# EAGLE schematic H04 (EAGLE 6.6.0)

## Sheet 1 of 4
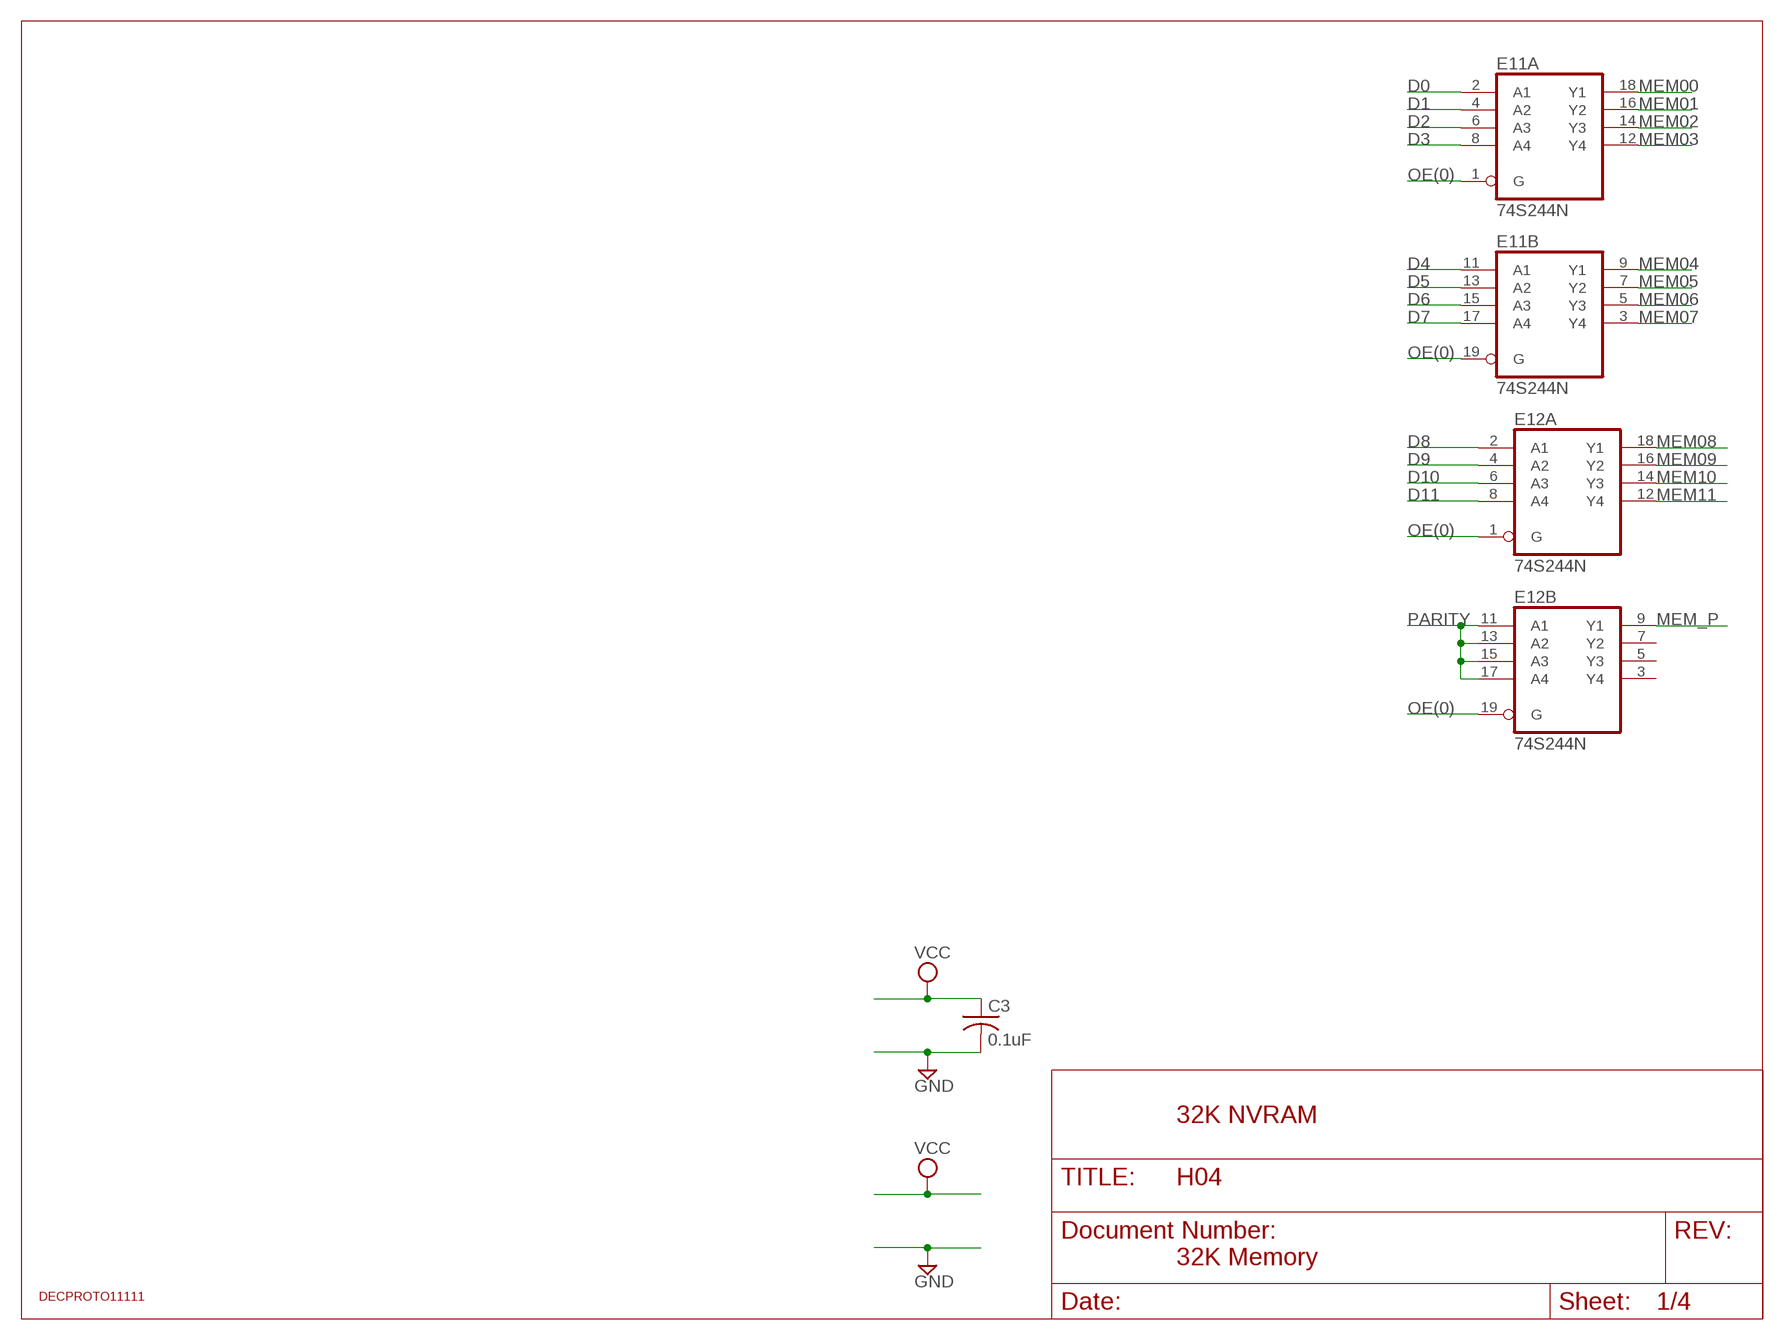
[diagram p0: schematic, sheet 1]

### Parts
C3  0.1uF  C-US050-025X075  [C050-025X075]
E11  74S244N  [DIL20]
E12  74S244N  [DIL20]
U$6  DECPROTO11111  [DECPROTO11111]

### Nets
D0: E11.2(A:A1) ; also sheet 3
D1: E11.4(A:A2) ; also sheet 3
D2: E11.6(A:A3) ; also sheet 3
D3: E11.8(A:A4) ; also sheet 3
D4: E11.11(B:A1) ; also sheet 3
D5: E11.13(B:A2) ; also sheet 3
D6: E11.15(B:A3) ; also sheet 3
D7: E11.17(B:A4) ; also sheet 3
D8: E12.2(A:A1) ; also sheet 3
D9: E12.4(A:A2) ; also sheet 3
D10: E12.6(A:A3) ; also sheet 3
D11: E12.8(A:A4) ; also sheet 3
GND [supply]: C3.2 ; also sheet 2,3
MEM00: E11.18(A:Y1) ; also sheet 2
MEM01: E11.16(A:Y2) ; also sheet 2
MEM02: E11.14(A:Y3) ; also sheet 2
MEM03: E11.12(A:Y4) ; also sheet 2
MEM04: E11.9(B:Y1) ; also sheet 2
MEM05: E11.7(B:Y2) ; also sheet 2
MEM06: E11.5(B:Y3) ; also sheet 2
MEM07: E11.3(B:Y4) ; also sheet 2
MEM08: E12.18(A:Y1) ; also sheet 3
MEM09: E12.16(A:Y2) ; also sheet 3
MEM10: E12.14(A:Y3) ; also sheet 3
MEM11: E12.12(A:Y4) ; also sheet 3
MEM_P: E12.9(B:Y1) ; also sheet 2
OE(0): E11.1(A:G) E11.19(B:G) E12.1(A:G) E12.19(B:G) ; also sheet 3
PARITY: E12.11(B:A1) E12.13(B:A2) E12.15(B:A3) E12.17(B:A4) ; also sheet 3
VCC [supply]: C3.1 ; also sheet 2
Unconnected: E12.3(B:Y4) E12.5(B:Y3) E12.7(B:Y2)

### Notes on the sheet
- 32K NVRAM
- 32K Memory

## Sheet 2 of 4
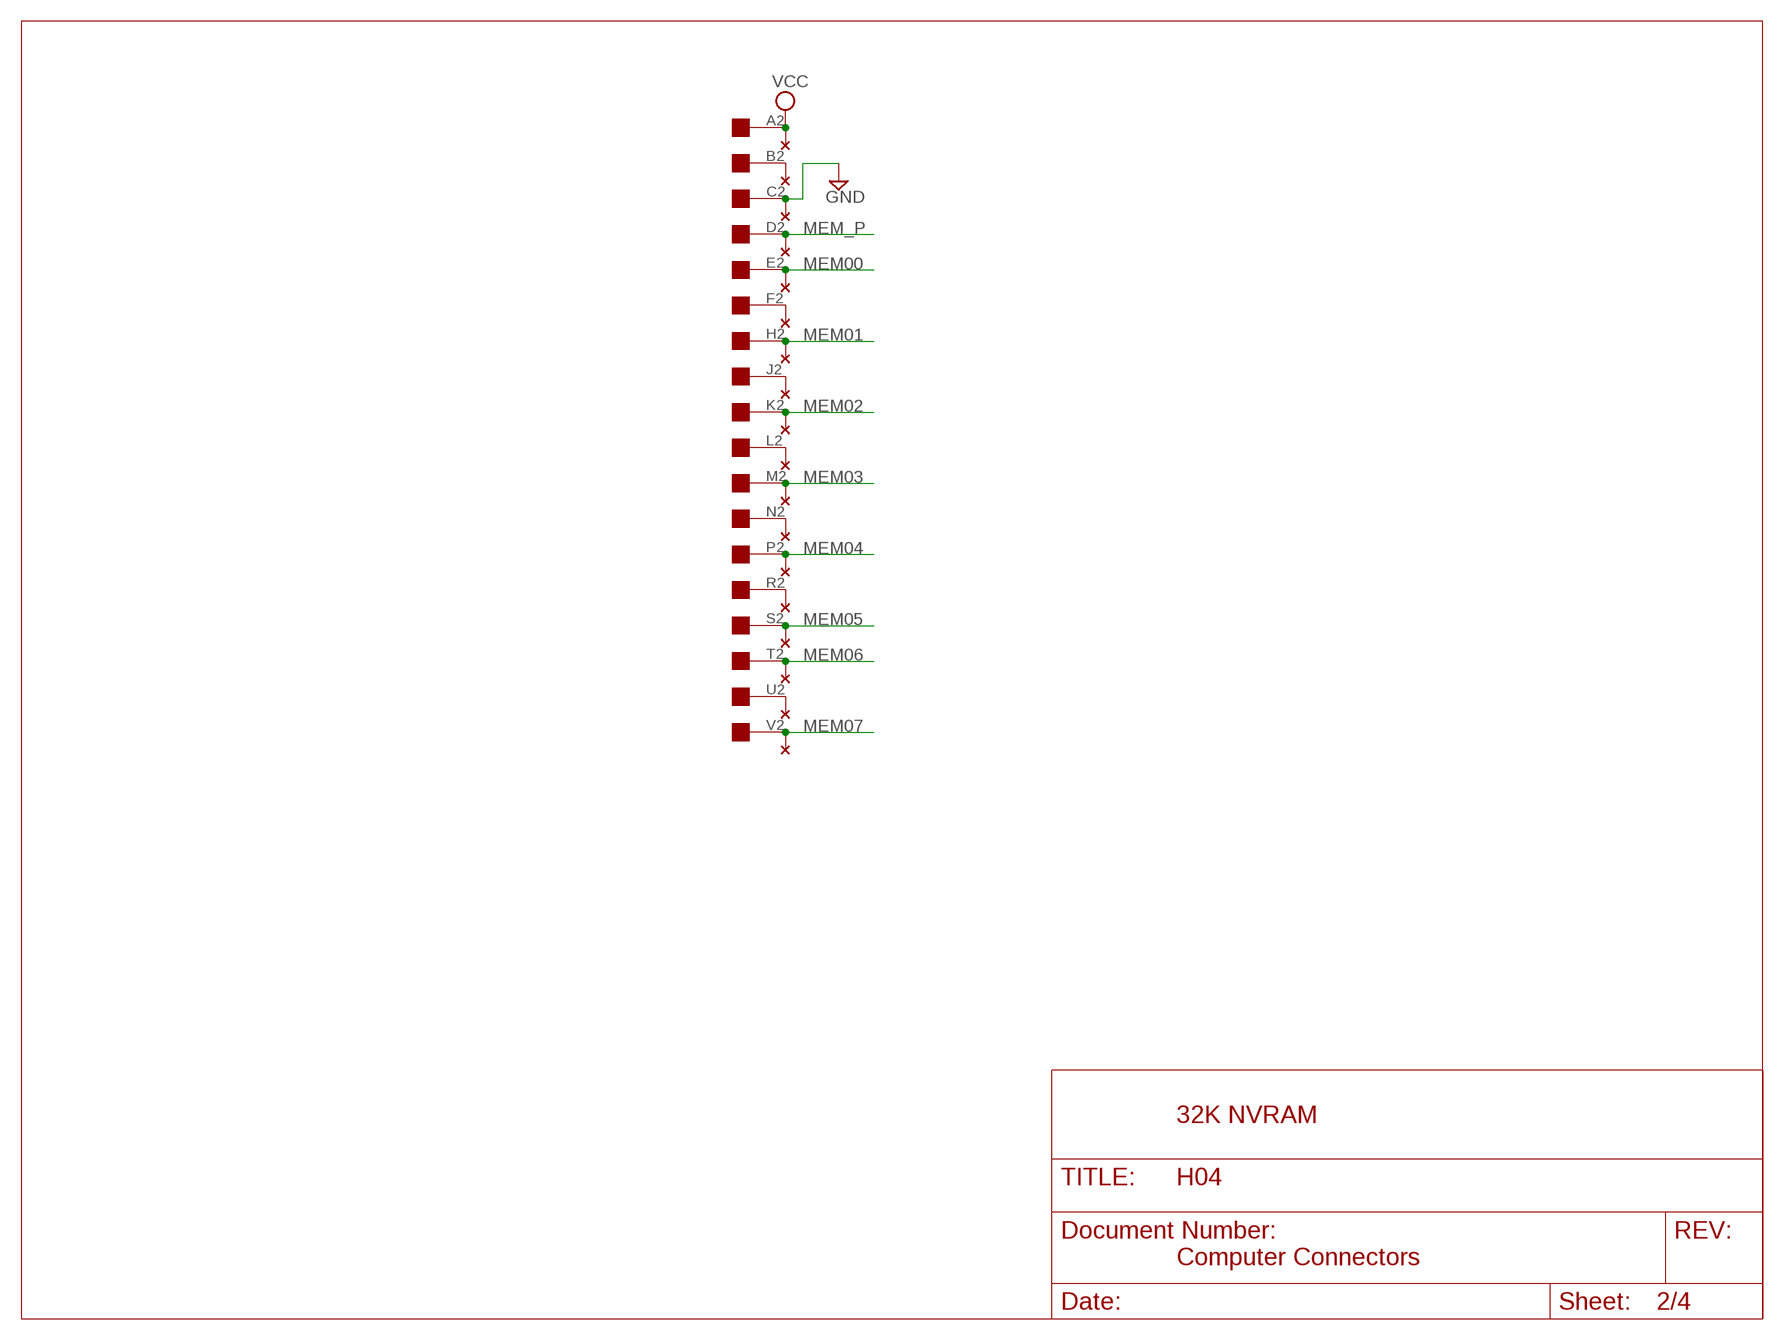
[diagram p1: schematic, sheet 2]

### Parts
H04  EDGE-1  [EDGE-CON1]
U$4  THRU-HOLE2  [THRU-HOLEB]

### Nets
GND [supply]: H04.C2 U$4.C2 ; also sheet 1,3
MEM00: H04.E2 U$4.E2 ; also sheet 1
MEM01: H04.H2 U$4.H2 ; also sheet 1
MEM02: H04.K2 U$4.K2 ; also sheet 1
MEM03: H04.M2 U$4.M2 ; also sheet 1
MEM04: H04.P2 U$4.P2 ; also sheet 1
MEM05: H04.S2 U$4.S2 ; also sheet 1
MEM06: H04.T2 U$4.T2 ; also sheet 1
MEM07: H04.V2 U$4.V2 ; also sheet 1
MEM_P: H04.D2 U$4.D2 ; also sheet 1
N$44: H04.J2 U$4.J2
N$45: H04.L2 U$4.L2
N$46: H04.N2 U$4.N2
N$112: H04.F2 U$4.F2
N$113: H04.R2 U$4.R2
N$114: H04.B2 U$4.B2
N$115: H04.U2 U$4.U2
VCC [supply]: H04.A2 U$4.A2 ; also sheet 1
Unconnected: U$4.A1 U$4.B1 U$4.C1 U$4.D1 U$4.E1 U$4.F1 U$4.H1 U$4.J1 U$4.K1 U$4.L1 U$4.M1 U$4.N1 U$4.P1 U$4.R1 U$4.S1 U$4.T1 U$4.U1 U$4.V1

### Notes on the sheet
- 32K NVRAM
- Computer Connectors

## Sheet 3 of 4
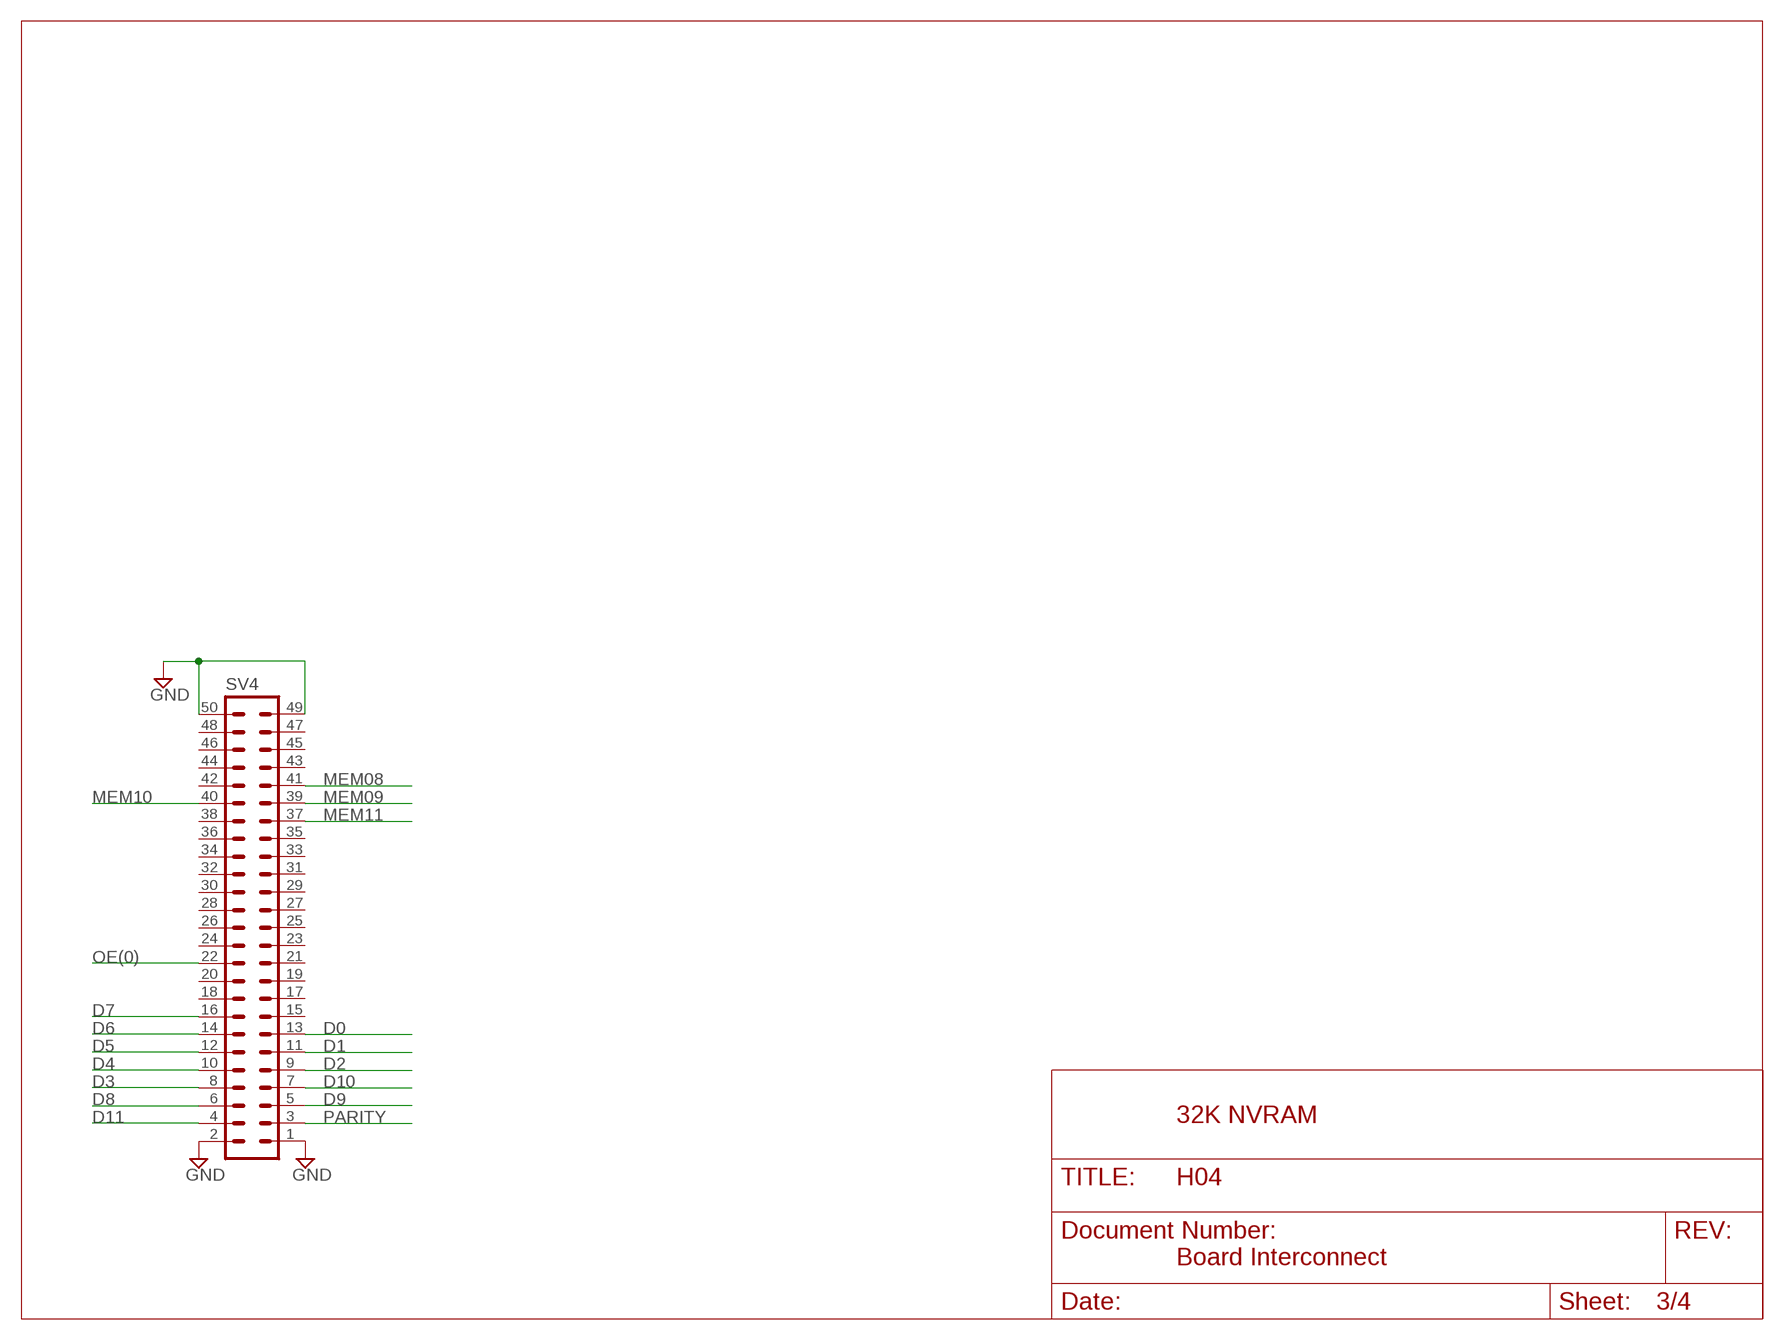
[diagram p2: schematic, sheet 3]

### Parts
SV4  ML50L  [ML50L]

### Nets
D0: SV4.13 ; also sheet 1
D1: SV4.11 ; also sheet 1
D2: SV4.9 ; also sheet 1
D3: SV4.8 ; also sheet 1
D4: SV4.10 ; also sheet 1
D5: SV4.12 ; also sheet 1
D6: SV4.14 ; also sheet 1
D7: SV4.16 ; also sheet 1
D8: SV4.6 ; also sheet 1
D9: SV4.5 ; also sheet 1
D10: SV4.7 ; also sheet 1
D11: SV4.4 ; also sheet 1
GND [supply]: SV4.1 SV4.2 SV4.49 SV4.50 ; also sheet 1,2
MEM08: SV4.41 ; also sheet 1
MEM09: SV4.39 ; also sheet 1
MEM10: SV4.40 ; also sheet 1
MEM11: SV4.37 ; also sheet 1
OE(0): SV4.22 ; also sheet 1
PARITY: SV4.3 ; also sheet 1
Unconnected: SV4.15 SV4.17 SV4.18 SV4.19 SV4.20 SV4.21 SV4.23 SV4.24 SV4.25 SV4.26 SV4.27 SV4.28 SV4.29 SV4.30 SV4.31 SV4.32 SV4.33 SV4.34 SV4.35 SV4.36 SV4.38 SV4.42 SV4.43 SV4.44 SV4.45 SV4.46 SV4.47 SV4.48

### Notes on the sheet
- 32K NVRAM
- Board Interconnect

## Sheet 4 of 4
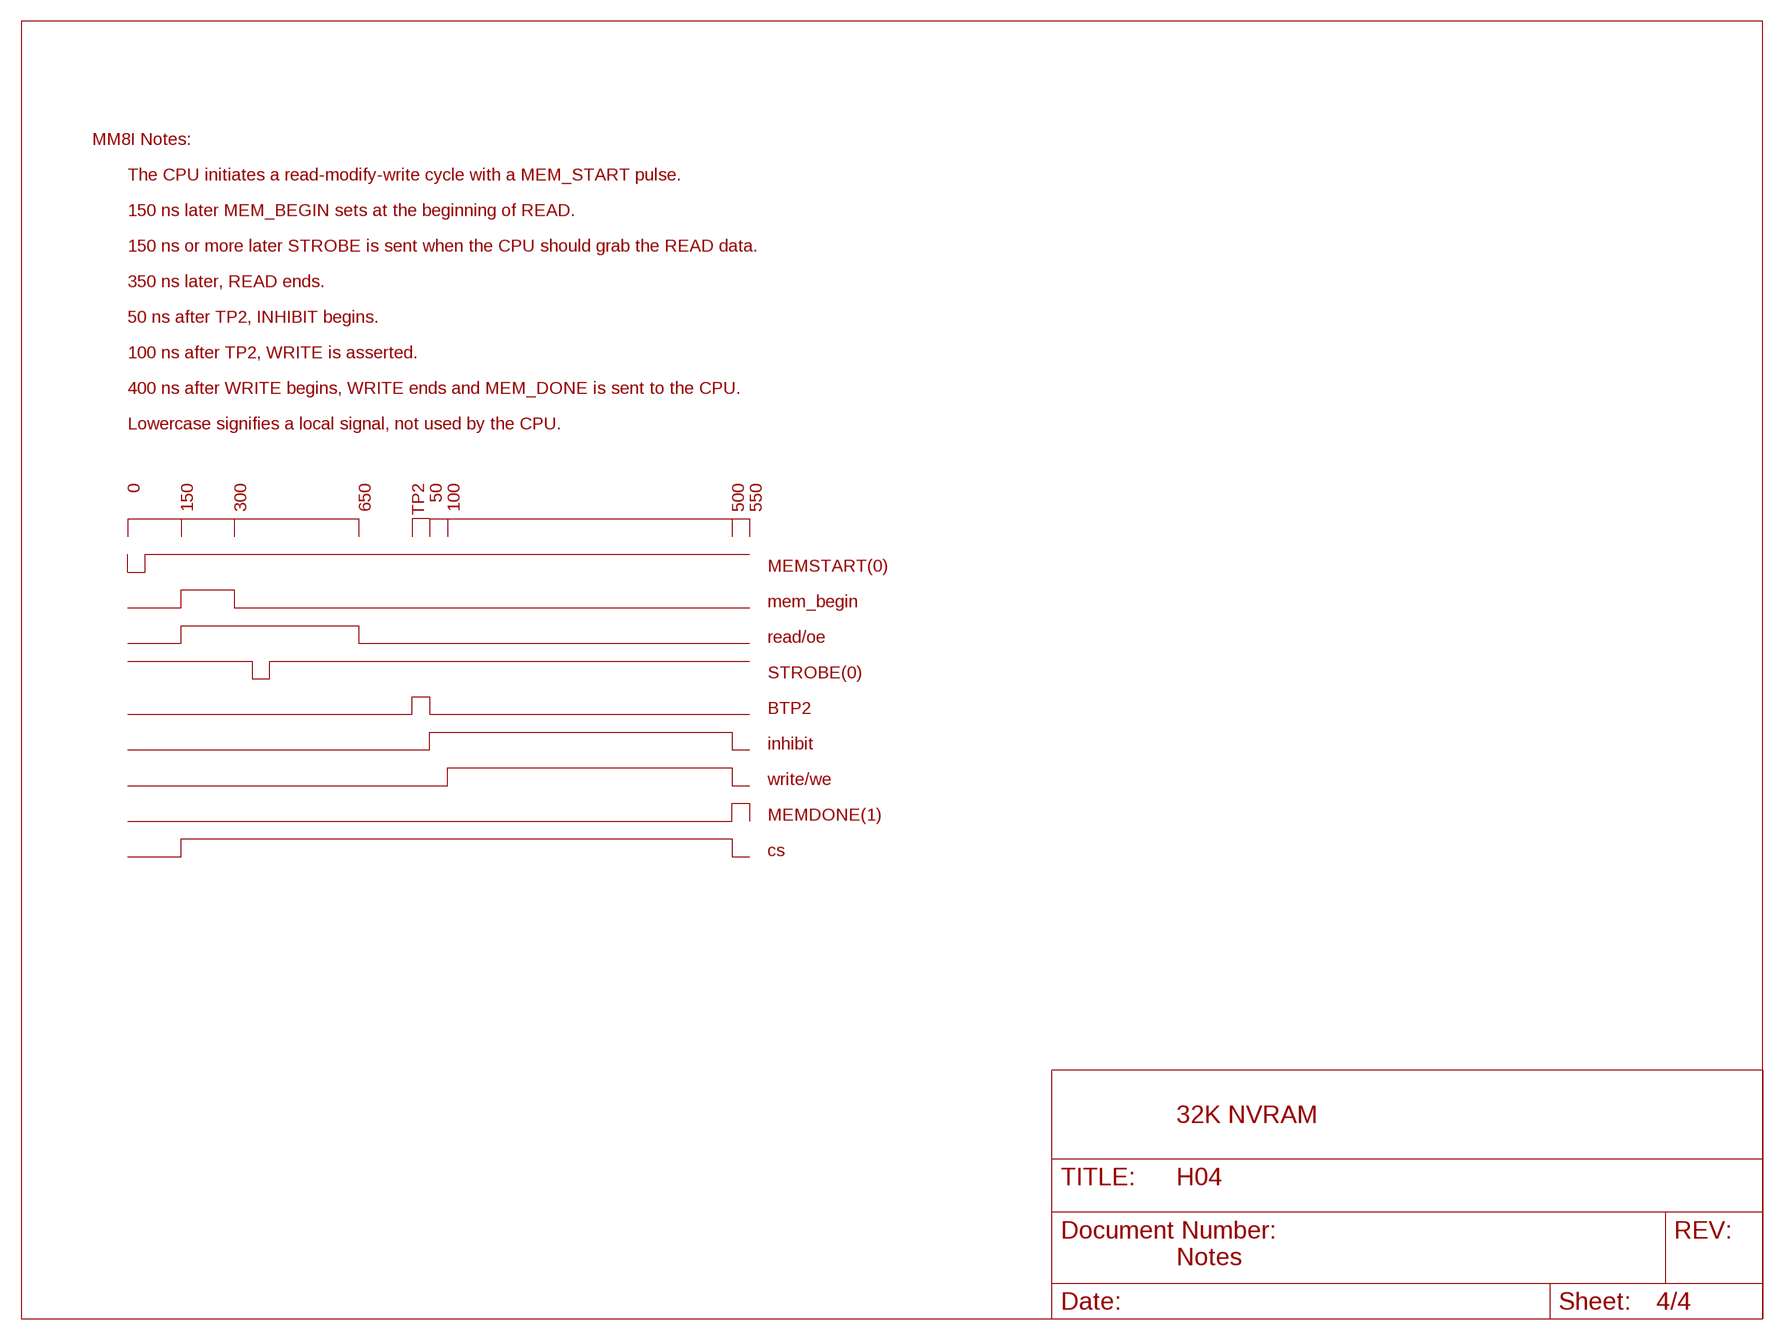
[diagram p3: schematic, sheet 4]

### Notes on the sheet
- MM8I Notes:
- The CPU initiates a read-modify-write cycle with a MEM_START pulse.
- 150 ns later MEM_BEGIN sets at the beginning of READ.
- 150 ns or more later STROBE is sent when the CPU should grab the READ data.
- 350 ns later, READ ends.
- 50 ns after TP2, INHIBIT begins.
- 100 ns after TP2, WRITE is asserted.
- 400 ns after WRITE begins, WRITE ends and MEM_DONE is sent to the CPU.
- Lowercase signifies a local signal, not used by the CPU.
- 0 | 150 | 300 | 650 | TP2 | 50 | 100 | 500 | 550
- MEMSTART(0)
- mem_begin
- read/oe
- STROBE(0)
- BTP2
- inhibit
- write/we
- MEMDONE(1)
- cs
- 32K NVRAM
- Notes

## Power pins joined to a net without a drawn wire
GND: E11.10(P:GND) E12.10(P:GND)
VCC: E11.20(P:VCC) E12.20(P:VCC)

## Library data of the parts
C3 = rcl:C-US: CAPACITOR, American symbol
E11 E12 = 74xx-us:74*244: Octal BUFFER and LINE DRIVER, 3-state
H04 = dec-con:EDGE-1: Single-Sided DEC Edge Connector -- (side 2)
SV4 = con-ml:ML50L: HARTING; OC_FARNELL: unknown; OC_NEWARK: unknown
U$4 = dec-con:THRU-HOLE2: Thru-Hole addition to double-sided edge connector.
U$6 = dec-con:DECPROTO: Various small DEC boards stuck together with break-away tab routing.

## Net classes
1 supply: width 0.711 mm